# Altium schematic sheet CoverPage.SchDoc
size A4; DrawnBy: Santiago Rodriguez; DocumentNumber: 10; Revision: V1; SheetNumber: 1; SheetTotal: 10
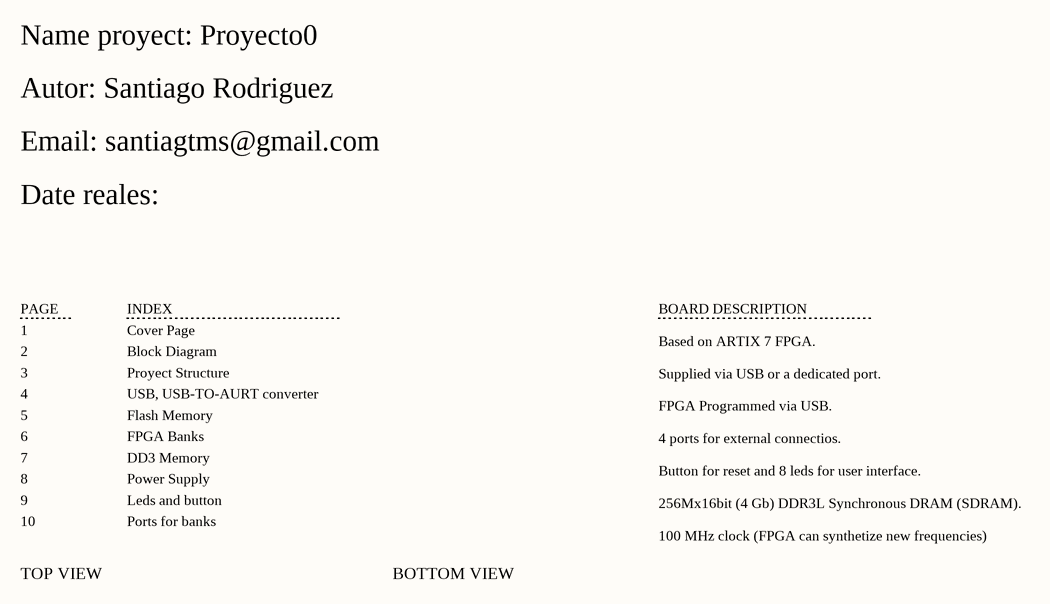
[diagram p0: CoverPage.SchDoc]

## Notes on the sheet
- Name proyect: Proyecto0
- Autor: Santiago Rodriguez
- Email: santiagtms@gmail.com
- Date reales:
- PAGE
- 1
- 2
- INDEX
- Cover Page
- Block Diagram
- BOARD DESCRIPTION
- 3
- 5
- 4
- Proyect Structure
- USB, USB-TO-AURT converter
- Flash Memory
- 6
- 7
- 8
- FPGA Banks
- DD3 Memory
- Power Supply
- 9
- 10
- Leds and button
- Ports for banks
- Based on ARTIX 7 FPGA.
  Supplied via USB or a dedicated port.
  FPGA Programmed via USB.
  4 ports for external connectios.
  Button for reset and 8 leds for user interface.
  256Mx16bit (4 Gb) DDR3L Synchronous DRAM (SDRAM).
  100 MHz clock (FPGA can synthetize new frequencies)
- TOP VIEW
- BOTTOM VIEW
- Proyect Name:
- Sheet Name:
- Drawn by:
- Revision:
- Sheet Number:
- Of
- Date: